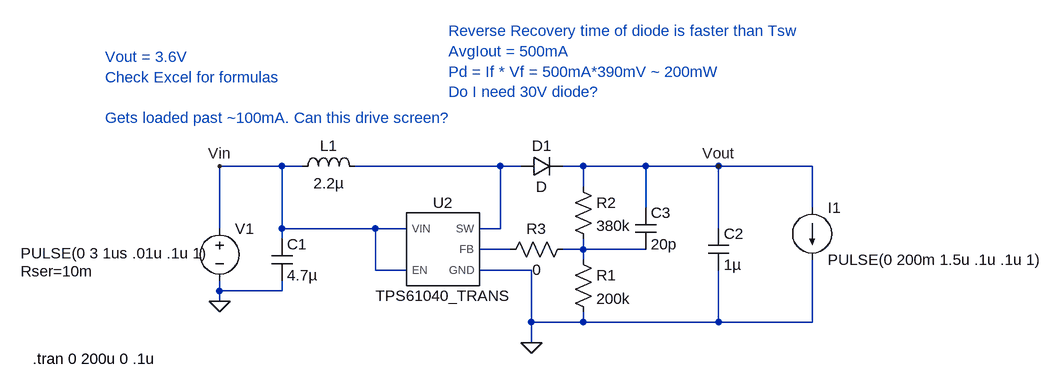
[diagram p0: schematic TPS61040.asc]
TPS61040.asc, the LTspice schematic file:
Version 4.1
SHEET 1 1192 680
WIRE 0 64 -96 64
WIRE 32 64 0 64
WIRE 336 64 112 64
WIRE 368 64 336 64
WIRE 464 64 432 64
WIRE 560 64 464 64
WIRE 672 64 560 64
WIRE 816 64 672 64
WIRE 464 96 464 64
WIRE 560 128 560 64
WIRE 816 128 816 64
WIRE -96 160 -96 64
WIRE 0 160 0 64
WIRE 144 160 0 160
WIRE 192 160 144 160
WIRE 336 160 336 64
WIRE 336 160 304 160
WIRE 672 160 672 64
WIRE 0 176 0 160
WIRE 352 192 304 192
WIRE 464 192 464 176
WIRE 464 192 432 192
WIRE 560 192 464 192
WIRE 464 208 464 192
WIRE 144 224 144 160
WIRE 192 224 144 224
WIRE 384 224 304 224
WIRE -96 256 -96 240
WIRE 0 256 0 240
WIRE 0 256 -96 256
WIRE -96 272 -96 256
WIRE 384 304 384 224
WIRE 464 304 464 288
WIRE 464 304 384 304
WIRE 672 304 672 224
WIRE 672 304 464 304
WIRE 816 304 816 208
WIRE 816 304 672 304
WIRE 384 336 384 304
FLAG -96 272 0
FLAG 384 336 0
FLAG -96 64 Vin
FLAG 672 64 Vout
SYMBOL voltage -96 144 R0
WINDOW 3 -306 54 Left 2
WINDOW 123 0 0 Left 0
WINDOW 39 -306 82 Left 2
SYMATTR InstName V1
SYMATTR Value PULSE(0 3 1us .01u .1u 1)
SYMATTR SpiceLine Rser=10m
SYMBOL res 448 192 R0
SYMATTR InstName R1
SYMATTR Value 200k
SYMBOL res 448 80 R0
SYMATTR InstName R2
SYMATTR Value 380k
SYMBOL ind 16 80 R270
WINDOW 0 32 56 VTop 2
WINDOW 3 5 56 VBottom 2
SYMATTR InstName L1
SYMATTR Value 2.2µ
SYMBOL diode 368 80 R270
WINDOW 0 32 32 VTop 2
WINDOW 3 0 32 VBottom 2
SYMATTR InstName D1
SYMBOL cap -16 176 R0
SYMATTR InstName C1
SYMATTR Value 4.7µ
SYMBOL cap 656 160 R0
SYMATTR InstName C2
SYMATTR Value 1µ
SYMBOL cap 544 128 R0
SYMATTR InstName C3
SYMATTR Value 20p
SYMBOL current 816 128 R0
WINDOW 123 0 0 Left 0
WINDOW 39 0 0 Left 0
SYMATTR InstName I1
SYMATTR Value PULSE(0 200m 1.5u .1u .1u 1)
SYMBOL TPS61040_TRANS 240 192 R0
SYMATTR InstName U2
SYMBOL res 448 176 R90
WINDOW 0 0 56 VBottom 2
WINDOW 3 32 56 VTop 2
SYMATTR InstName R3
SYMATTR Value 0
TEXT -272 -104 Left 2 ;Vout = 3.6V\nCheck Excel for formulas\n \nGets loaded past ~100mA. Can this drive screen?
TEXT 256 -144 Left 2 ;Reverse Recovery time of diode is faster than Tsw\nAvgIout = 500mA\nPd = If * Vf = 500mA*390mV ~ 200mW\nDo I need 30V diode?
TEXT -384 360 Left 2 !.tran 0 200u 0 .1u

The netlist it stands for:
* TPS61040.asc
V1 Vin 0 PULSE(0 3 1us .01u .1u 1) Rser=10m
R1 N003 0 200k
R2 Vout N003 380k
L1 Vin N001 2.2µ
D1 N001 Vout D
C1 Vin 0 4.7µ
C2 Vout 0 1µ
C3 Vout N003 20p
I1 Vout 0 PULSE(0 200m 1.5u .1u .1u 1)
X§U2 Vin N002 N001 Vin 0 TPS61040_TRANS  ; pins EN FB SW VIN GND
R3 N003 N002 0
.model D D
.lib standard.dio
* Vout = 3.6V
* Check Excel for formulas
* Gets loaded past ~100mA. Can this drive screen?
* Reverse Recovery time of diode is faster than Tsw
* AvgIout = 500mA
* Pd = If * Vf = 500mA*390mV ~ 200mW
* Do I need 30V diode?
.tran 0 200u 0 .1u
.lib C:\Users\adnan\OneDrive\Documents\LTspice\MyLib\TPS61040.lib
.backanno
.end